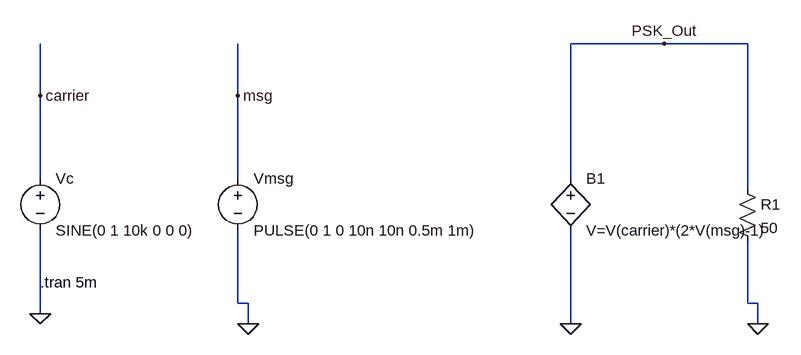
[diagram p0: schematic PSK.asc]
PSK.asc, the LTspice schematic file:
Version 4.1
SHEET 1 924 680
WIRE 720 -80 576 -80
WIRE 848 -80 720 -80
WIRE -240 0 -240 -80
WIRE 64 0 64 -80
WIRE -240 128 -240 0
WIRE 64 128 64 0
WIRE 576 128 576 -80
WIRE 848 144 848 -80
WIRE 64 320 64 208
WIRE 80 320 64 320
WIRE 848 320 848 224
WIRE 864 320 848 320
WIRE -240 336 -240 208
WIRE 80 352 80 320
WIRE 576 352 576 208
WIRE 864 352 864 320
FLAG -240 336 0
FLAG 80 352 0
FLAG 576 352 0
FLAG 864 352 0
FLAG -240 0 carrier
FLAG 64 0 msg
FLAG 720 -80 PSK_Out
SYMBOL voltage -240 112 R0
WINDOW 123 0 0 Left 0
WINDOW 39 0 0 Left 0
SYMATTR InstName Vc
SYMATTR Value SINE(0 1 10k 0 0 0)
SYMBOL voltage 64 112 R0
WINDOW 123 0 0 Left 0
WINDOW 39 0 0 Left 0
SYMATTR InstName Vmsg
SYMATTR Value PULSE(0 1 0 10n 10n 0.5m 1m)
SYMBOL res 832 128 R0
SYMATTR InstName R1
SYMATTR Value 50
SYMBOL bv 576 112 R0
SYMATTR InstName B1
SYMATTR Value V=V(carrier)*(2*V(msg)-1)
TEXT -240 288 Left 2 !.tran 5m

The netlist it stands for:
* PSK.asc
Vc carrier 0 SINE(0 1 10k 0 0 0)
Vmsg msg 0 PULSE(0 1 0 10n 10n 0.5m 1m)
R1 PSK_Out 0 50
B1 PSK_Out 0 V=V(carrier)*(2*V(msg)-1)
.tran 5m
.backanno
.end